# EasyEDA schematic thevenin equivalent.json

## Sheets
1 fig3: TITLE: Sheet_1; REV: 1.0; Date: 2021-12-02; Sheet: 1/1; Drawn By: huseyin34; Company: Your Company
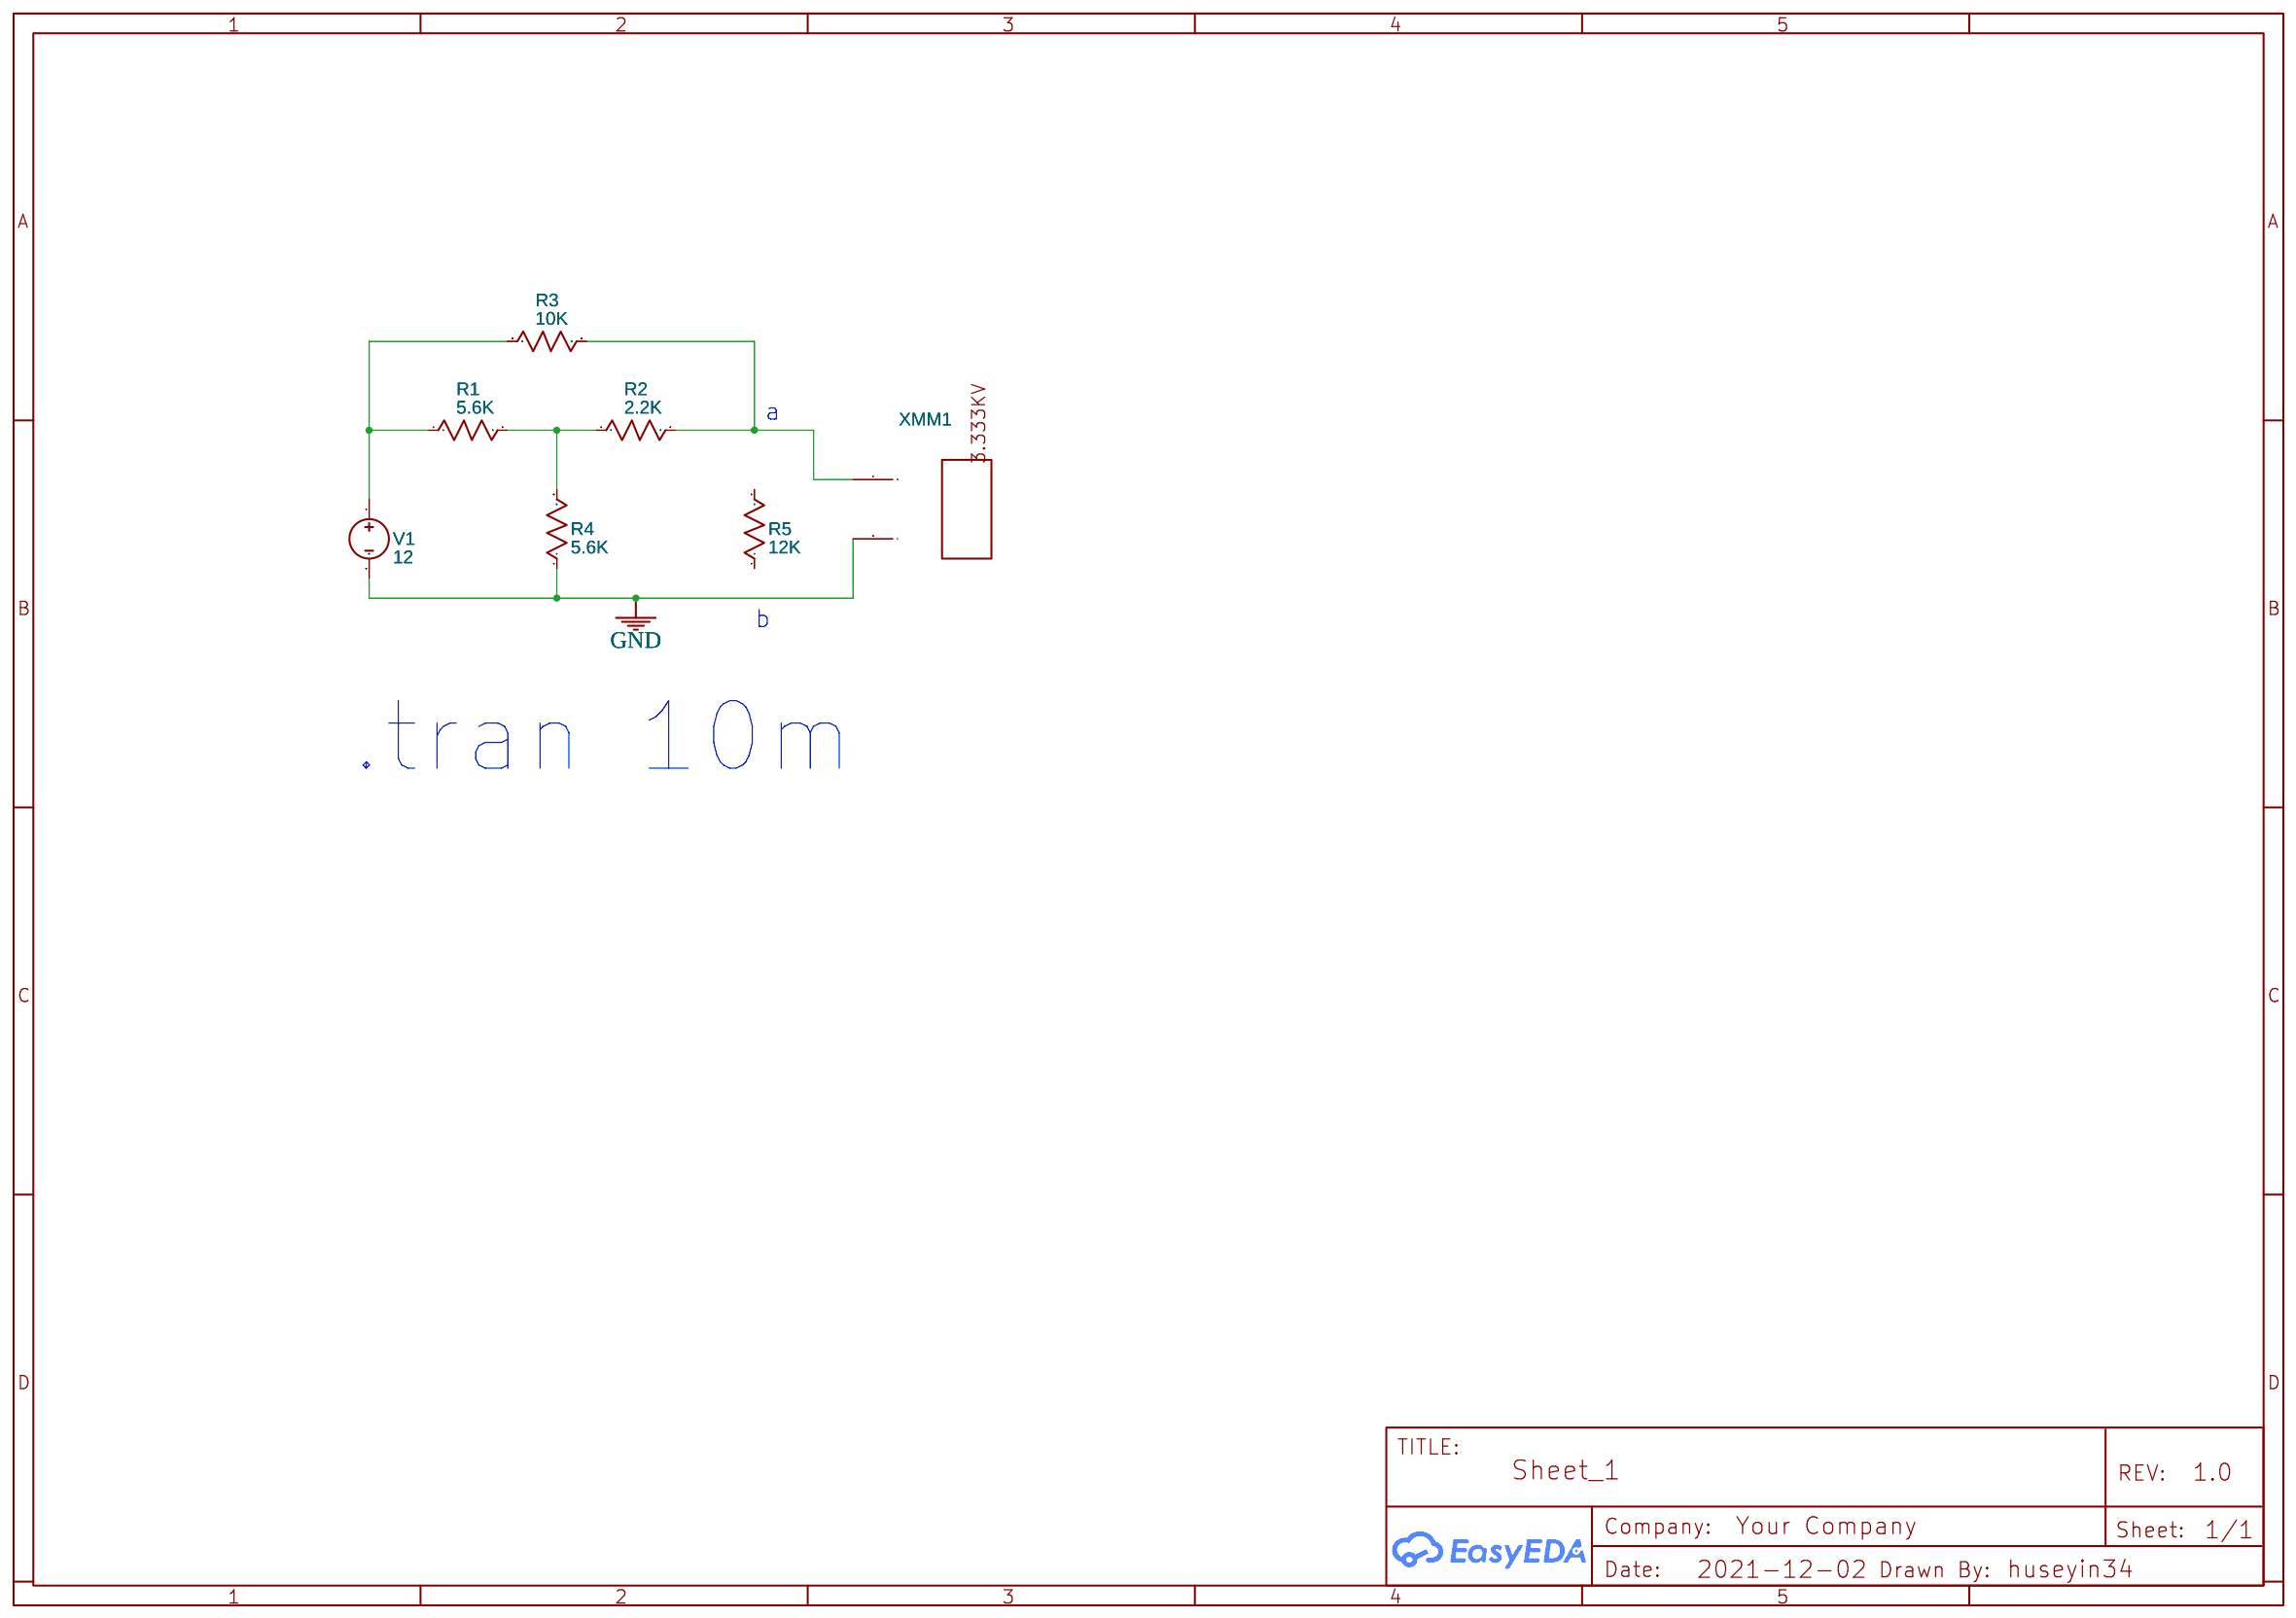
[diagram p0: fig3]
2 thevenin equiv: TITLE: Sheet_2
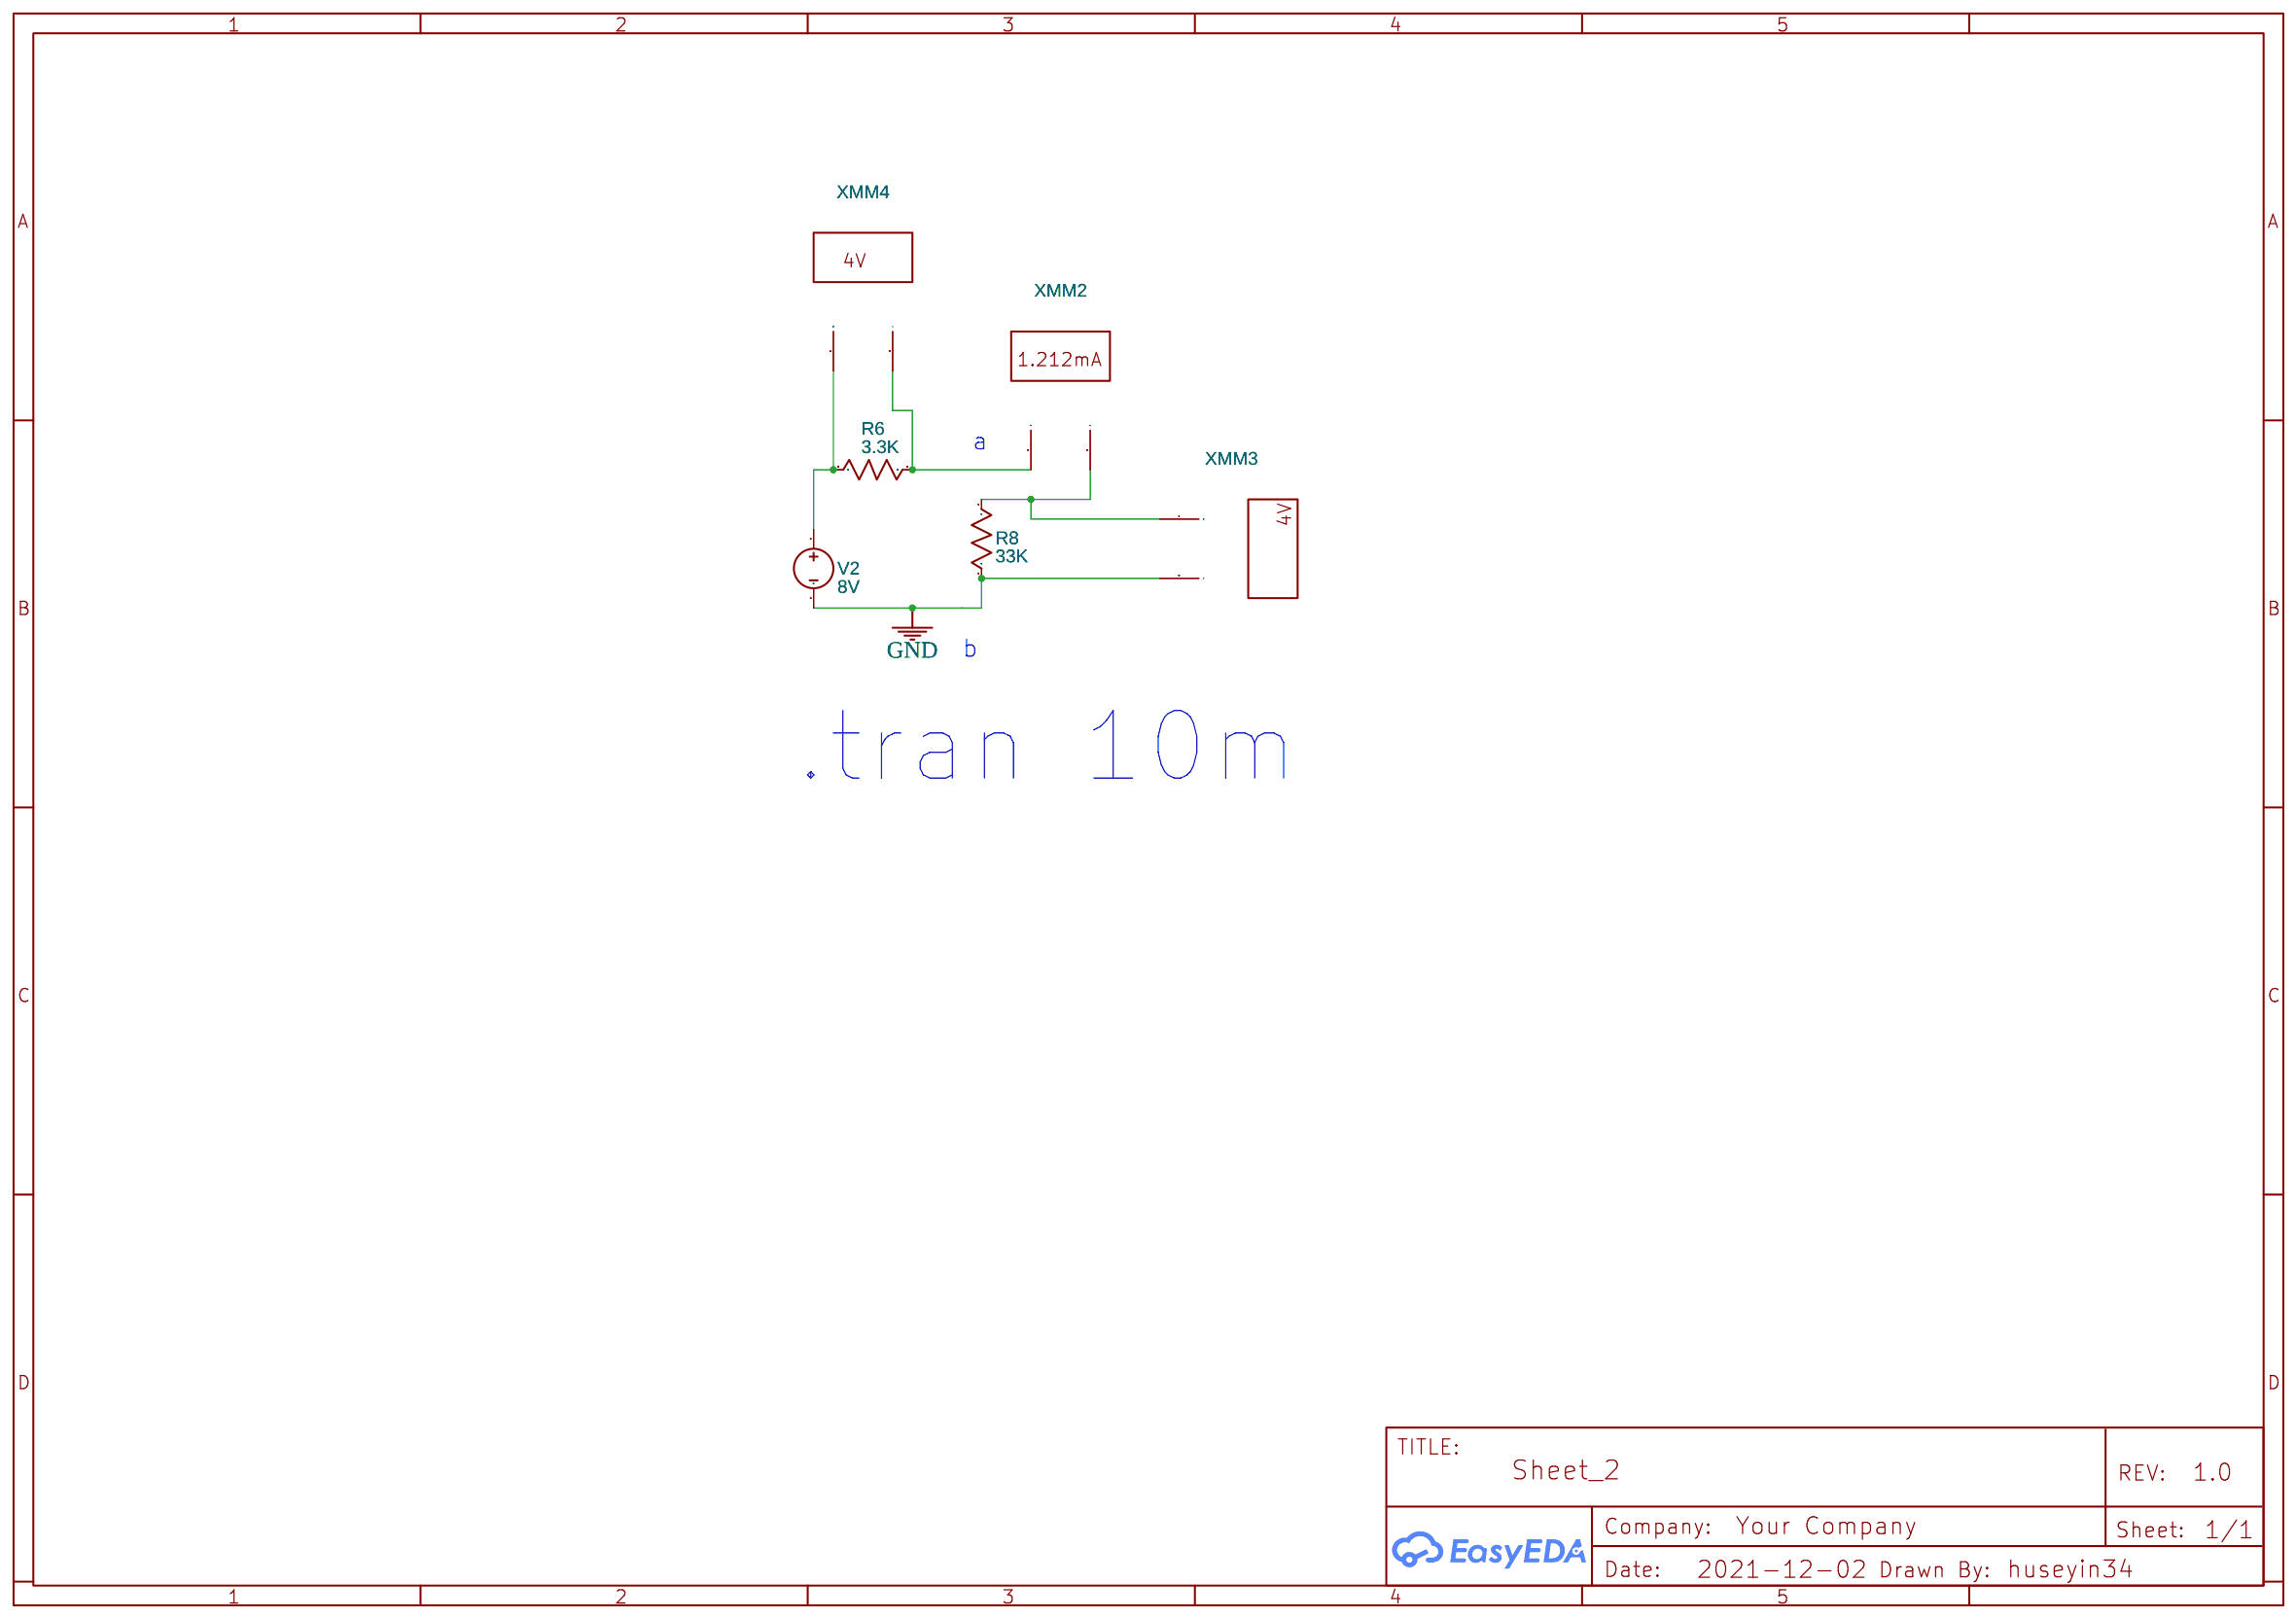
[diagram p1: thevenin equiv]
3 Norton Equiv.: TITLE: Sheet_2
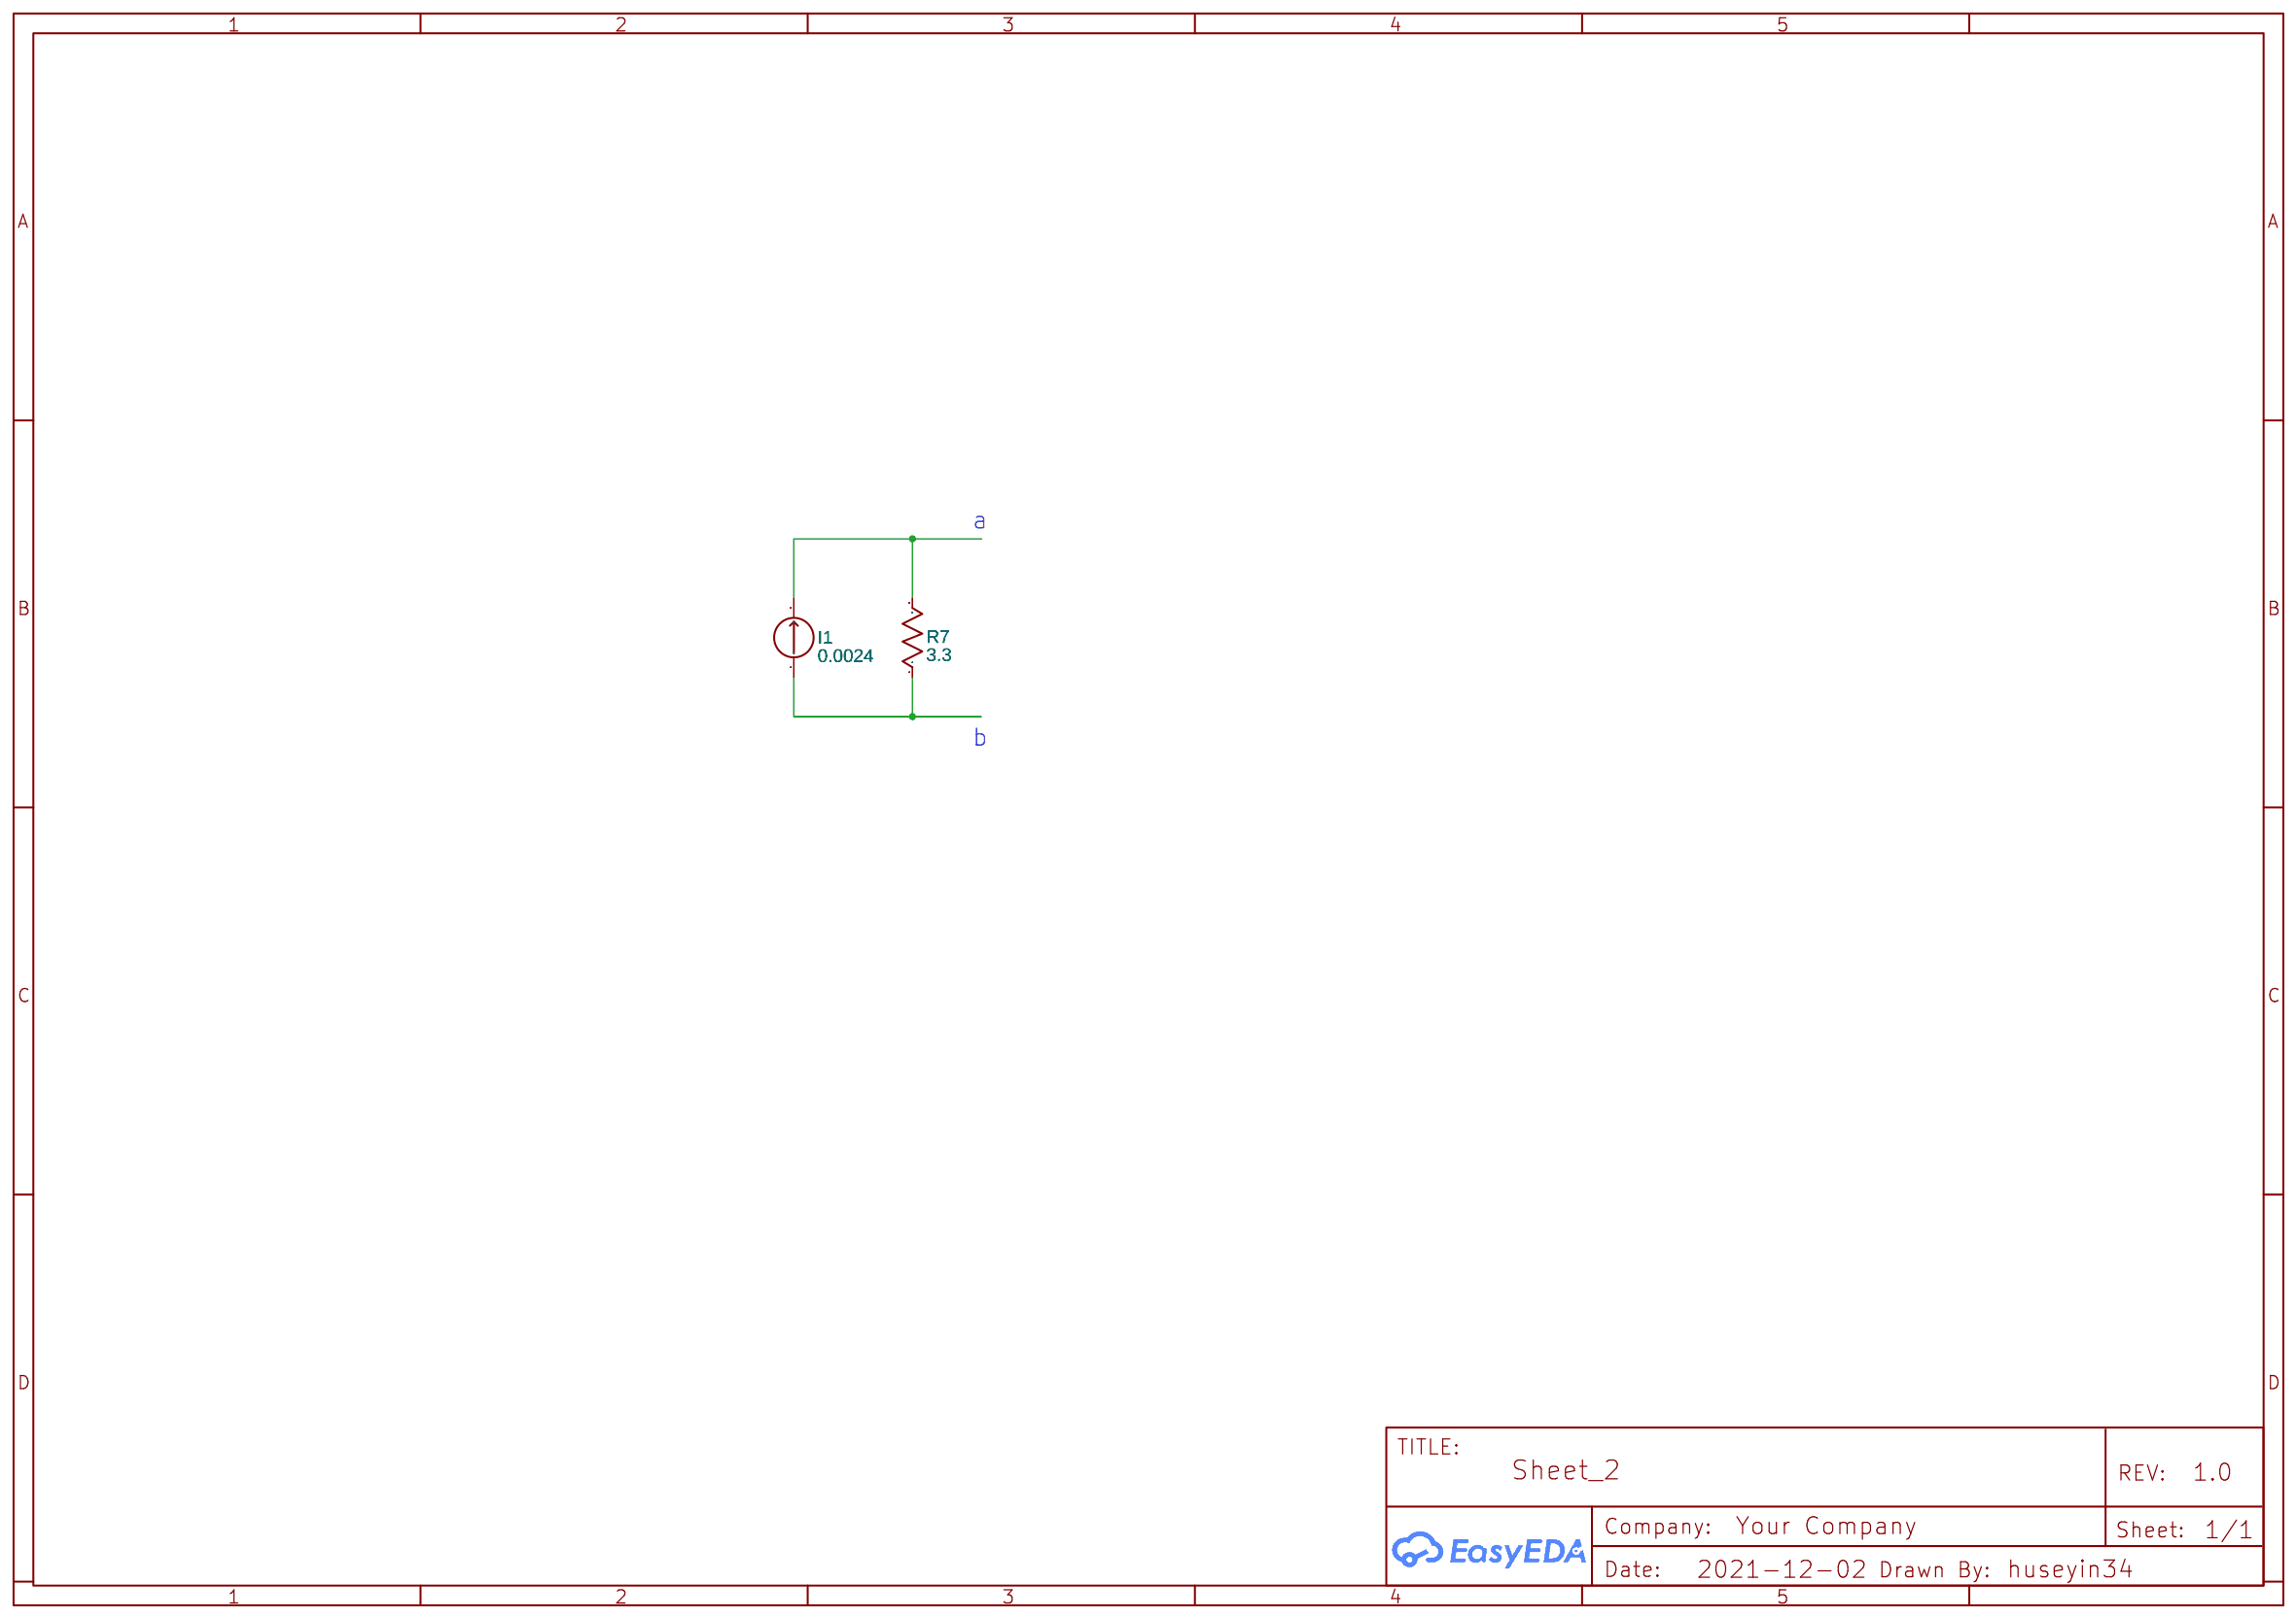
[diagram p2: Norton Equiv.]

## Parts
sheet fig3
R1  5.6K  [AXIAL-0.3]
R2  2.2K  [AXIAL-0.3]
R3  10K  [AXIAL-0.3]
R4  5.6K  [AXIAL-0.3]
R5  12K  [AXIAL-0.3]
V1  12  [HDR1X2]
XMM1  Multimeter
sheet Norton Equiv.
I1  0.0024  [2P-5.08]
R7  3.3  [AXIAL-0.3]
sheet thevenin equiv
R6  3.3K  [AXIAL-0.3]
R8  33K  [AXIAL-0.3]
V2  8V  [HDR1X2]
XMM2  Multimeter
XMM3  Multimeter
XMM4  Multimeter

## Library data of the parts
R1-R8 = Resistor_US: Resistance: 1k; Contributor: EasyEDA; Supplier: YUJING
V1 V2 = VDC: Contributor: EasyEDA; sim: true
XMM1 XMM2 = MULTIMETER: Supplier: LCSC; Multimeter Type: Amper; Power Type: AC; Voltmeter resistance: 10μ; Ammeter resistance: 1G; NameDisplay: 0; Contributor: EasyEDA; sim: true
I1 = IDC: Contributor: EasyEDA; sim: true
XMM3 XMM4 = MULTIMETER: Supplier: LCSC; Multimeter Type: Voltmeter; Power Type: AC; Voltmeter resistance: 10μ; Ammeter resistance: 1G; NameDisplay: 0; Contributor: EasyEDA; sim: true

## Nets
GND: R4.1 R8.1 V1.2 V2.2 XMM1.2(I) XMM3.2(I)
Net-(I1-1): I1.1 R7.1
Net-(I1-2): I1.2 R7.2
Net-(R1-1): R1.1 R3.1 V1.1
Net-(R1-2): R1.2 R2.1 R4.2
Net-(R2-2): R2.2 R3.2 XMM1.1(+)
Net-(R6-1): R6.1 V2.1 XMM4.1(+)
Net-(R6-2): R6.2 XMM2.1(+) XMM4.2(I)
Net-(R8-2): R8.2 XMM2.2(I) XMM3.1(+)

Not connected (* = marked no-connect by the designer): R5 1 2

## Notes on the sheets
sheet 1
- a
- b
- .tran 10m
sheet 2
- a
- b
- .tran 10m
sheet 3
- a
- b
